# EAGLE design mysz (EAGLE 9.5.2)
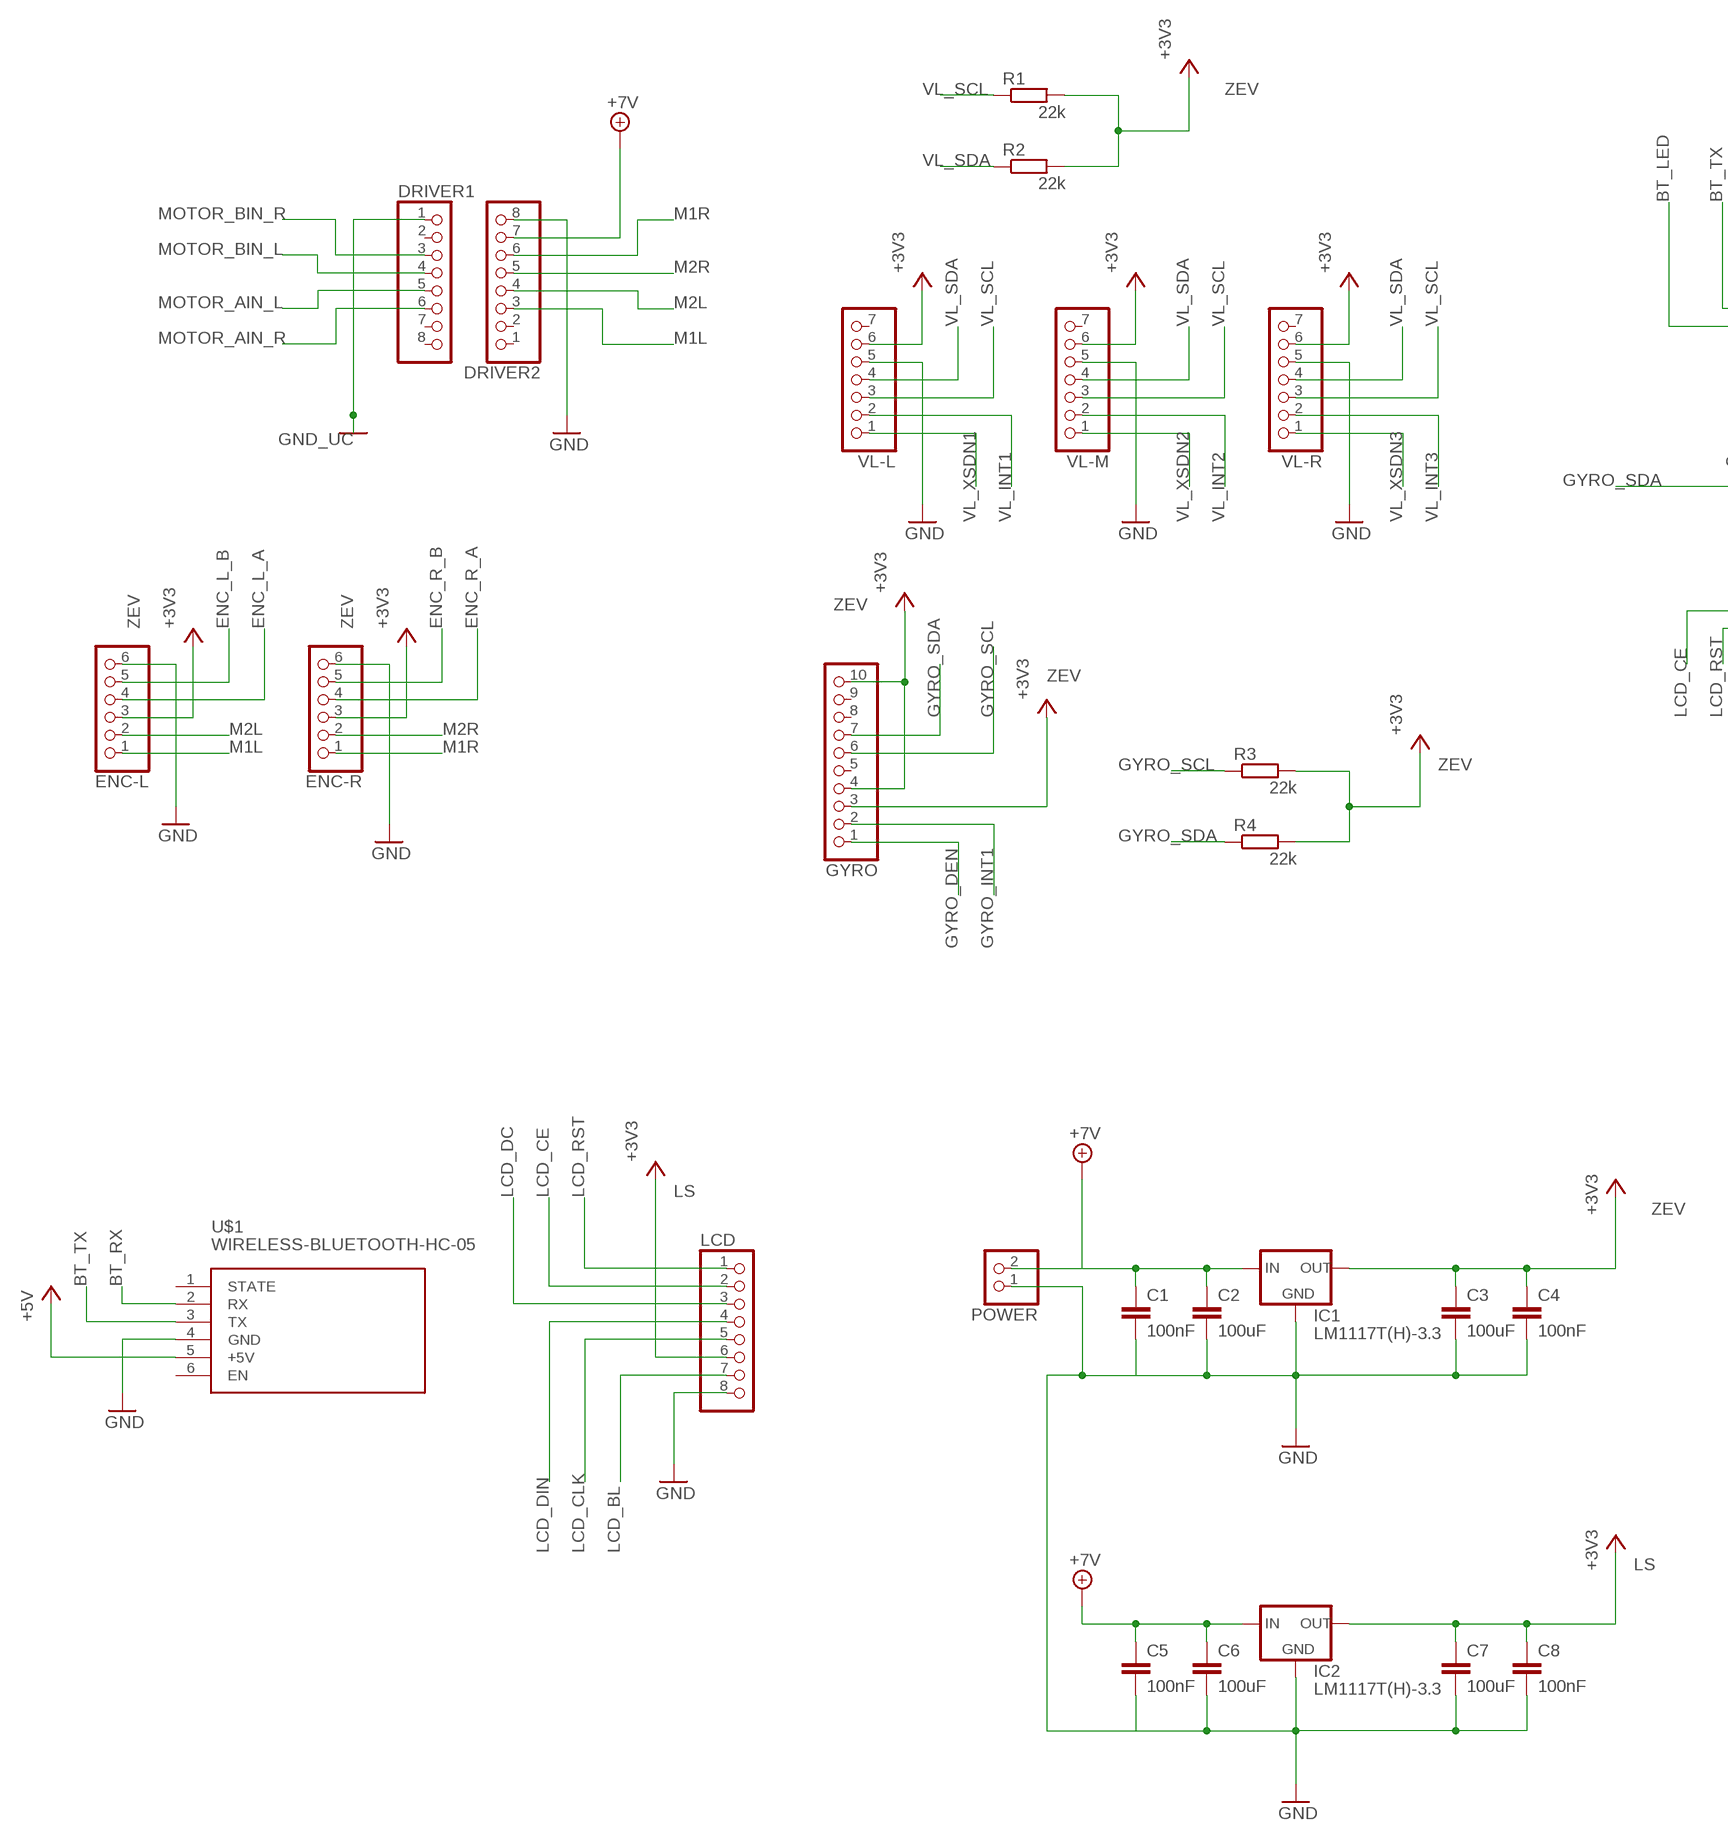
[diagram p0: schematic, sheet 1, part 1 of 2]
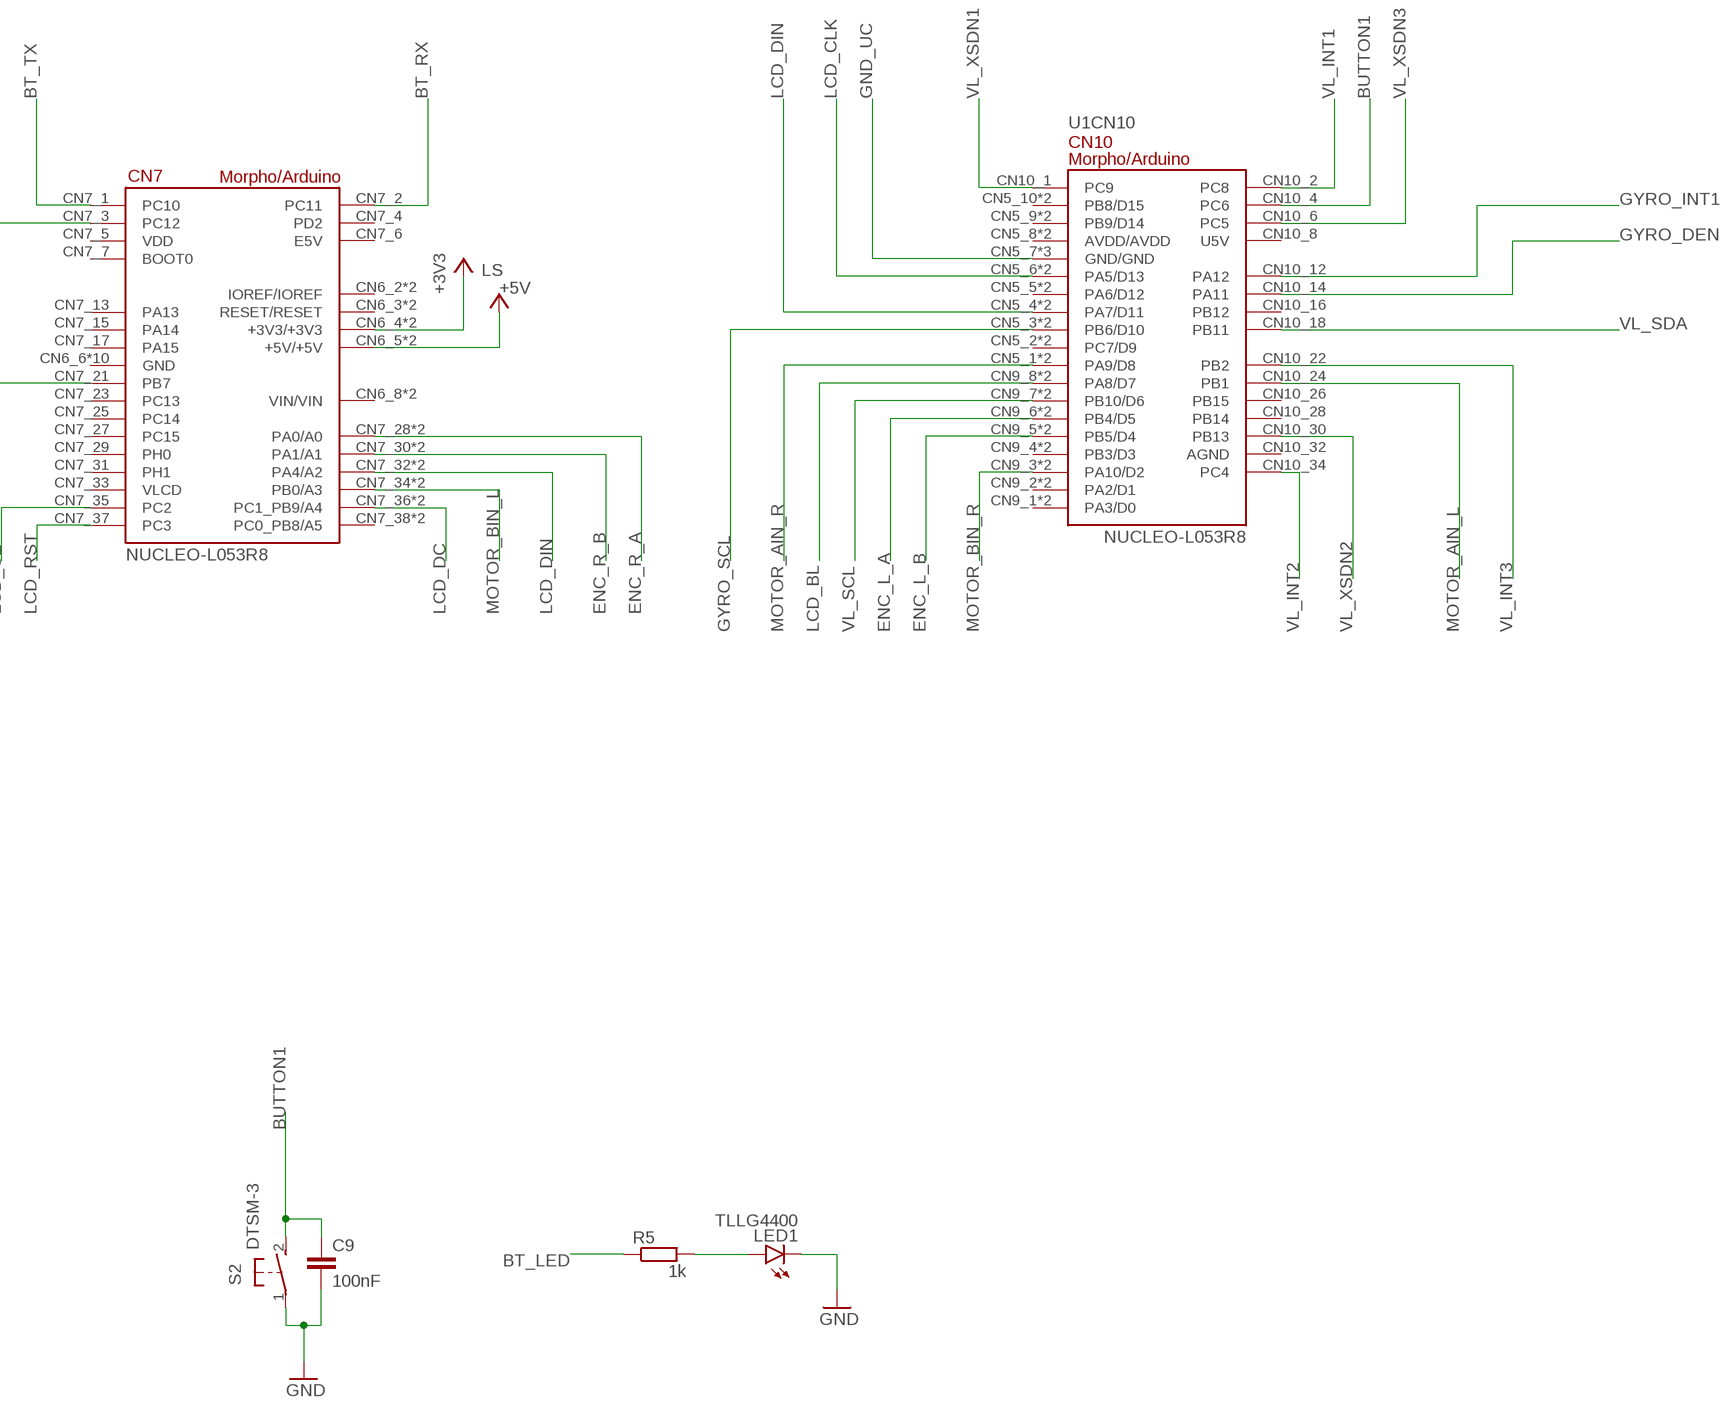
[diagram p1: schematic, sheet 1, part 2 of 2]

## Parts
C1  100nF  C2,5-3  [C2.5-3]
C2  100uF  C2,5-3  [C2.5-3]
C3  100uF  C2,5-3  [C2.5-3]
C4  100nF  C2,5-3  [C2.5-3]
C5  100nF  C2,5-3  [C2.5-3]
C6  100uF  C2,5-3  [C2.5-3]
C7  100uF  C2,5-3  [C2.5-3]
C8  100nF  C2,5-3  [C2.5-3]
C9  100nF  C2,5-3  [C2.5-3]
DRIVER1  PINHD-1X8  [1X08]
DRIVER2  PINHD-1X8  [1X08]
ENC-L  PINHD-1X6  [1X06]
ENC-R  PINHD-1X6  [1X06]
GYRO  PINHD-1X10  [1X10]
IC1  LM1117T(H)-3.3  [TO220H]
IC2  LM1117T(H)-3.3  [TO220H]
LCD  PINHD-1X8  [1X08]
LED1  TLLG4400  [LED3MM]
POWER  PINHD-1X2  [1X02]
R1  22k  R-EU_0207/10  [0207/10]
R2  22k  R-EU_0207/10  [0207/10]
R3  22k  R-EU_0207/10  [0207/10]
R4  22k  R-EU_0207/10  [0207/10]
R5  1k  R-EU_0207/10  [0207/10]
S2  DTSM-3  [DTSM-3]
U1  NUCLEO-L053R8  [MODULE_NUCLEO-L053R8]
U$1  WIRELESS-BLUETOOTH-HC-05  [WIRELESS-BLUETOOTH-HC-05]
VL-L  PINHD-1X7/90  [1X07/90]
VL-M  PINHD-1X7/90  [1X07/90]
VL-R  PINHD-1X7/90  [1X07/90]

## Nets
+3V3: VL-L.6 VL-M.6 VL-R.6
+5V: U1.CN6_5(CN7:+5V/+5V) U1.CN7_18(CN7:+5V/+5V) U$1.5(+5V)
+7V: C1.1 C2.1 C5.1 C6.1 IC1.3(IN) IC2.3(IN) POWER.2
BT_LED: R5.1 U1.CN7_3(CN7:PC12)
BT_RX: U1.CN7_2(CN7:PC11) U$1.2(RX)
BT_TX: U1.CN7_1(CN7:PC10) U$1.3(TX)
BUTTON1: C9.1 S2.2 U1.CN10_4(CN10:PC6)
ENC_L_A: ENC-L.4 U1.CN9_6(CN10:PB4/D5) U1.CN10_27(CN10:PB4/D5)
ENC_L_B: ENC-L.5 U1.CN9_5(CN10:PB5/D4) U1.CN10_29(CN10:PB5/D4)
ENC_R_A: ENC-R.4 U1.CN7_28(CN7:PA0/A0) U1.CN8_1(CN7:PA0/A0)
ENC_R_B: ENC-R.5 U1.CN7_30(CN7:PA1/A1) U1.CN8_2(CN7:PA1/A1)
GND: C1.2 C2.2 C3.2 C4.2 C5.2 C6.2 C7.2 C8.2 DRIVER2.8 ENC-L.6 ENC-R.6 IC1.1(GND) IC2.1(GND) LCD.8 POWER.1 U$1.4(GND) VL-L.5 VL-M.5 VL-R.5
GND_UC: DRIVER1.1 U1.CN5_7(CN10:GND/GND) U1.CN10_9(CN10:GND/GND) U1.CN10_20(CN10:GND/GND) ; supply symbol labelled GND
GYRO_DEN: GYRO.1 U1.CN10_14(CN10:PA11)
GYRO_INT1: GYRO.2 U1.CN10_12(CN10:PA12)
GYRO_SCL: GYRO.6 R3.1 U1.CN5_3(CN10:PB6/D10) U1.CN10_17(CN10:PB6/D10)
GYRO_SDA: GYRO.7 R4.1 U1.CN7_21(CN7:PB7)
LCD_BL: LCD.7 U1.CN9_8(CN10:PA8/D7) U1.CN10_23(CN10:PA8/D7)
LCD_CE: LCD.2 U1.CN7_35(CN7:PC2)
LCD_CLK: LCD.5 U1.CN5_6(CN10:PA5/D13) U1.CN10_11(CN10:PA5/D13)
LCD_DC: LCD.3 U1.CN7_36(CN7:PC1_PB9/A4) U1.CN8_5(CN7:PC1_PB9/A4)
LCD_DIN: LCD.4 U1.CN5_4(CN10:PA7/D11) U1.CN7_32(CN7:PA4/A2) U1.CN8_3(CN7:PA4/A2) U1.CN10_15(CN10:PA7/D11)
LCD_RST: LCD.1 U1.CN7_37(CN7:PC3)
LS: C7.1 C8.1 IC2.2(OUT) LCD.6 U1.CN6_4(CN7:+3V3/+3V3) U1.CN7_16(CN7:+3V3/+3V3) ; supply symbol labelled +3V3
M1L: DRIVER2.3 ENC-L.1
M1R: DRIVER2.6 ENC-R.1
M2L: DRIVER2.4 ENC-L.2
M2R: DRIVER2.5 ENC-R.2
MOTOR_AIN_L: DRIVER1.5 U1.CN10_24(CN10:PB1)
MOTOR_AIN_R: DRIVER1.6 U1.CN5_1(CN10:PA9/D8) U1.CN10_21(CN10:PA9/D8)
MOTOR_BIN_L: DRIVER1.4 U1.CN7_34(CN7:PB0/A3) U1.CN8_4(CN7:PB0/A3)
MOTOR_BIN_R: DRIVER1.3 U1.CN9_3(CN10:PA10/D2) U1.CN10_33(CN10:PA10/D2)
N$1: C9.2 LED1.K(C) S2.1 ; supply symbol labelled GND
N$5: LED1.A R5.2
N$6: DRIVER2.7 ; supply symbol labelled +7V
VL_INT1: U1.CN10_2(CN10:PC8) VL-L.2
VL_INT2: U1.CN10_34(CN10:PC4) VL-M.2
VL_INT3: U1.CN10_22(CN10:PB2) VL-R.2
VL_SCL: R1.1 U1.CN9_7(CN10:PB10/D6) U1.CN10_25(CN10:PB10/D6) VL-L.3 VL-M.3 VL-R.3
VL_SDA: R2.1 U1.CN10_18(CN10:PB11) VL-L.4 VL-M.4 VL-R.4
VL_XSDN1: U1.CN10_1(CN10:PC9) VL-L.1
VL_XSDN2: U1.CN10_30(CN10:PB13) VL-M.1
VL_XSDN3: U1.CN10_6(CN10:PC5) VL-R.1
ZEV: C3.1 C4.1 ENC-L.3 ENC-R.3 GYRO.3 GYRO.4 GYRO.10 IC1.2(OUT) R1.2 R2.2 R3.2 R4.2 ; supply symbol labelled +3V3
Unconnected: DRIVER1.2 DRIVER1.7 DRIVER1.8 DRIVER2.1 DRIVER2.2 GYRO.5 GYRO.8 GYRO.9 U1.CN5_2(CN10:PC7/D9) U1.CN5_5(CN10:PA6/D12) U1.CN5_8(CN10:AVDD/AVDD) U1.CN5_9(CN10:PB9/D14) U1.CN5_10(CN10:PB8/D15) U1.CN6_2(CN7:IOREF/IOREF) U1.CN6_3(CN7:RESET/RESET) U1.CN6_6(CN7:GND) U1.CN6_7(CN7:GND) U1.CN6_8(CN7:VIN/VIN) U1.CN7_4(CN7:PD2) U1.CN7_5(CN7:VDD) U1.CN7_6(CN7:E5V) U1.CN7_7(CN7:BOOT0) U1.CN7_8(CN7:GND) U1.CN7_12(CN7:IOREF/IOREF) U1.CN7_13(CN7:PA13) U1.CN7_14(CN7:RESET/RESET) U1.CN7_15(CN7:PA14) U1.CN7_17(CN7:PA15) U1.CN7_19(CN7:GND) U1.CN7_20(CN7:GND) U1.CN7_22(CN7:GND) U1.CN7_23(CN7:PC13) U1.CN7_24(CN7:VIN/VIN) U1.CN7_25(CN7:PC14) U1.CN7_27(CN7:PC15) U1.CN7_29(CN7:PH0) U1.CN7_31(CN7:PH1) U1.CN7_33(CN7:VLCD) U1.CN7_38(CN7:PC0_PB8/A5) U1.CN8_6(CN7:PC0_PB8/A5) U1.CN9_1(CN10:PA3/D0) U1.CN9_2(CN10:PA2/D1) U1.CN9_4(CN10:PB3/D3) U1.CN10_3(CN10:PB8/D15) U1.CN10_5(CN10:PB9/D14) U1.CN10_7(CN10:AVDD/AVDD) U1.CN10_8(CN10:U5V) U1.CN10_13(CN10:PA6/D12) U1.CN10_16(CN10:PB12) U1.CN10_19(CN10:PC7/D9) U1.CN10_26(CN10:PB15) U1.CN10_28(CN10:PB14) U1.CN10_31(CN10:PB3/D3) U1.CN10_32(CN10:AGND) U1.CN10_35(CN10:PA2/D1) U1.CN10_37(CN10:PA3/D0) U1.CN11_1(CN7:GND) U1.CN11_2(CN7:GND) U1.CN12_1(CN7:GND) U1.CN12_2(CN7:GND) U$1.1(STATE) U$1.6(EN) VL-L.7 VL-M.7 VL-R.7

## Library data of the parts
C1-C9 = capacitor-wima:C: CAPACITOR naming: grid - package width
DRIVER1 DRIVER2 LCD = pinhead:PINHD-1X8: PIN HEADER
ENC-L ENC-R = pinhead:PINHD-1X6: PIN HEADER
GYRO = pinhead:PINHD-1X10: PIN HEADER
IC1 IC2 = lm1117_10:LM1117?-*: 800mA Low-Dropout Linear Regulator Source: http://www.ti.com/lit/ds/symlink/lm1117-n.pdf; MF: Texas Instruments; MPN: LM1117T-3.3; OC_FARNELL: 1469056; OC_NEWARK: 13B5347
LED1 = led:TLLG4400: Low Current (2mA) LED 3 mm Tinted Diffused Package color GREEN Source: Data sheet <http://www.farnell.com/datasheets/391098.pdf>; MF: VISHAY SEMICONDUCTOR; OC_FARNELL: 1612435
POWER = pinhead:PINHD-1X2: PIN HEADER
R1-R5 = rcl:R-EU_: RESISTOR, European symbol; SPICEPREFIX: R
S2 = dtsm3:DTSM-3
U1 = NUCLEO-L053R8:NUCLEO-L053R8: STM32 Nucleo-64 development board with STM32L053R8T6 MCU, supports Arduino and ST morpho connectivity; AVAILABILITY: Unavailable; DESCRIPTION: STM32L053R8, mbed-Enabled Development Nucleo-64 STM32L0 ARM® Cortex®-M0+ MCU 32-Bit Embedded Evaluation Board; MF: STMicroelectronics; MP: NUCLEO-L053R8; PACKAGE: None; PRICE: None
U$1 = diy-modules:WIRELESS-BLUETOOTH-HC-05: Bluetooth Transceiver Module based on HC-05 board Tutorial is available here: https://arduino-info.wikispaces.com/BlueTooth-HC05-HC06-Modules-How-To Click here to find device on ebay.com <http://www.ebay.com/sch/hc-05+module+rs232>
VL-L VL-M VL-R = pinhead:PINHD-1X7: PIN HEADER

## Board
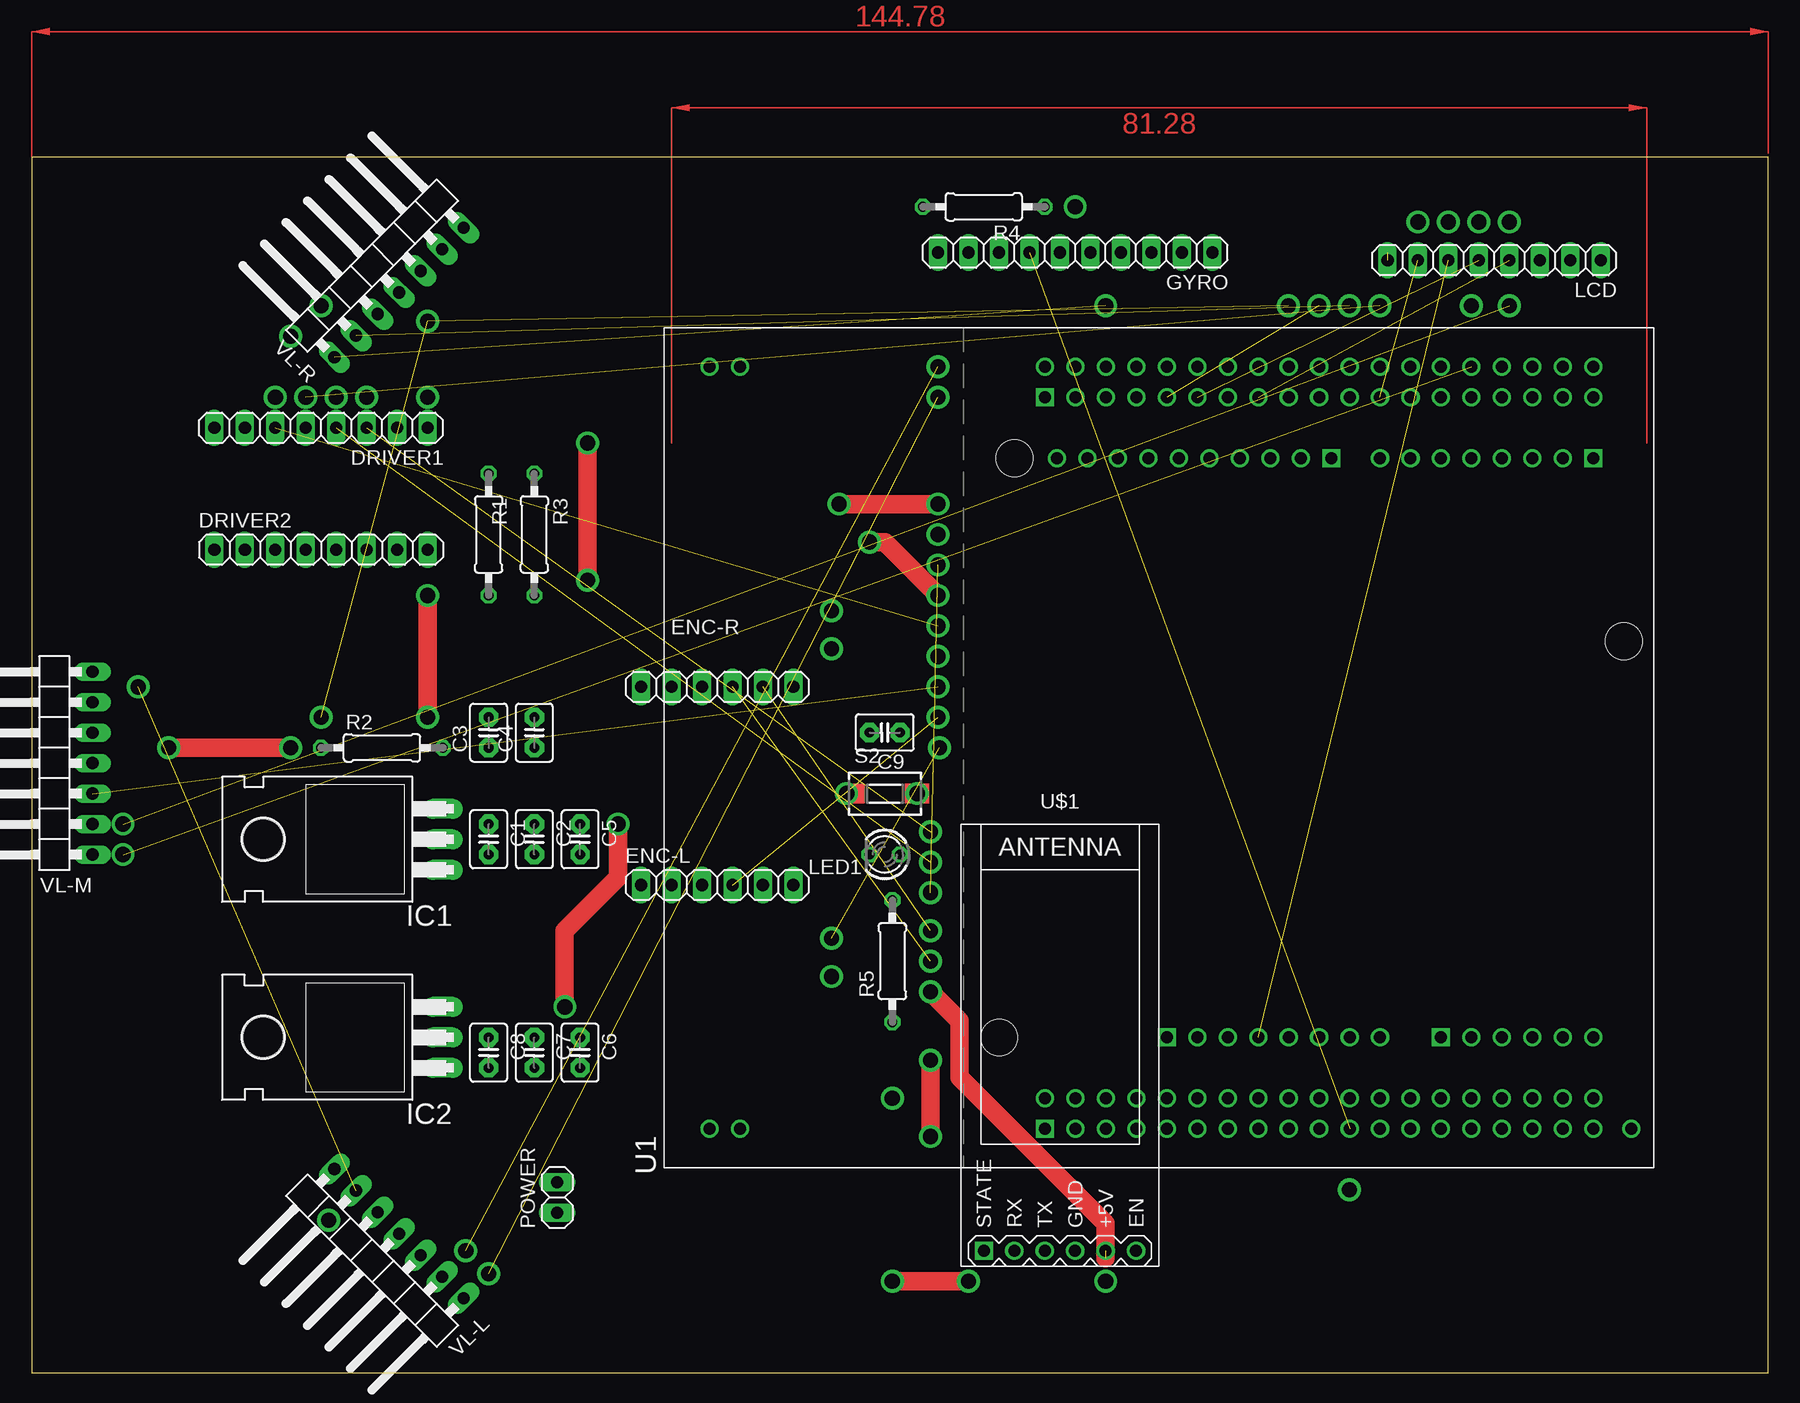
[diagram p2: board, top side]
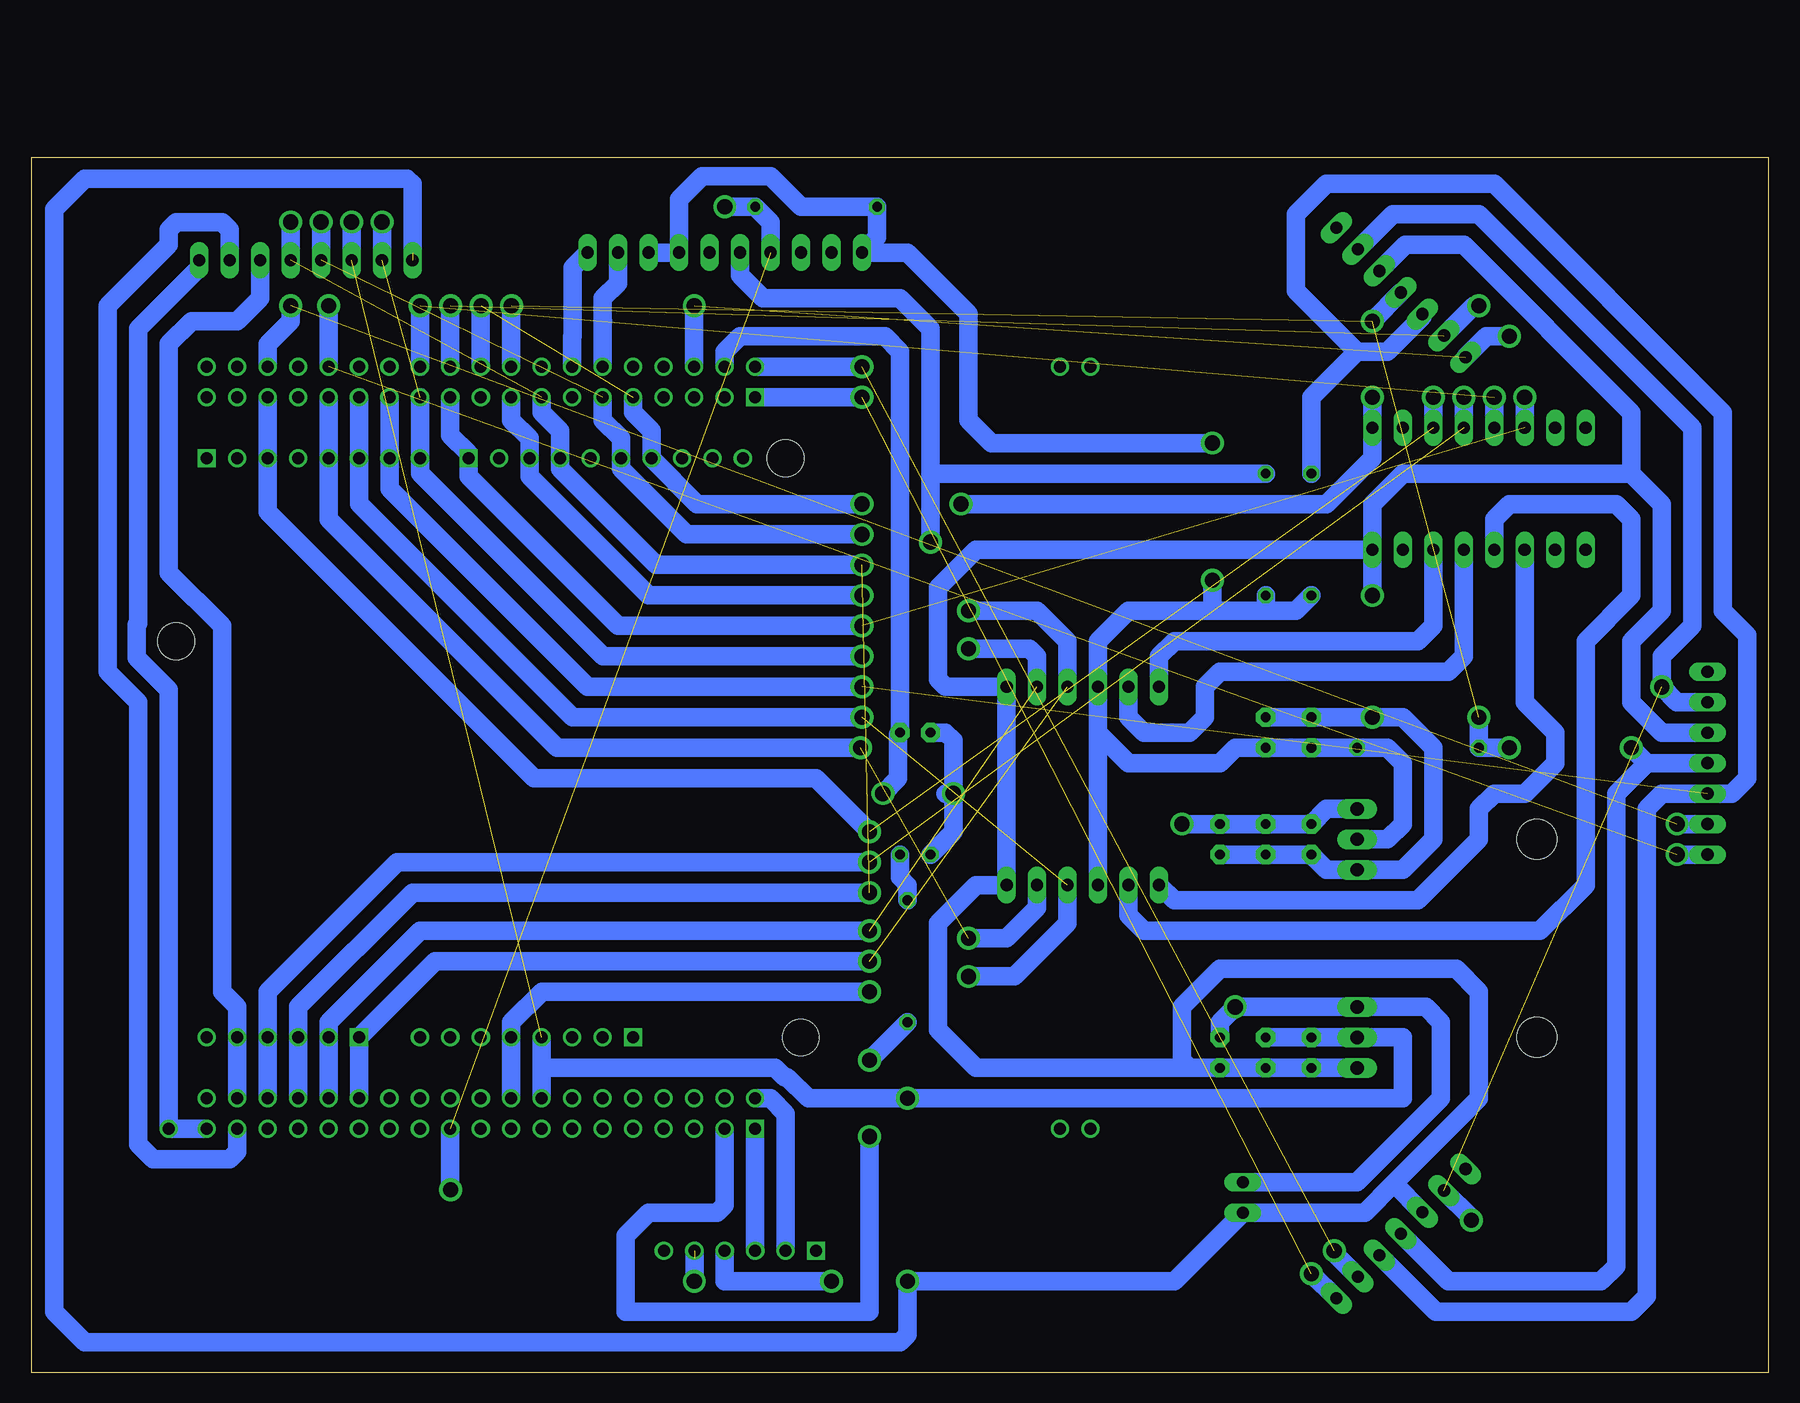
[diagram p3: board, bottom side, seen from below]

Size 144.76 x 101.27 mm. Coordinates in mm from the lower left corner, seen from the top.
Outline: 0,0 144.76,0 144.76,101.27 0,101.27 0,0
Copper layers (1*16): Top 0.035mm / dielectric 1.5mm / Bottom 0.035mm
Design rules "default": minimum track width 6mil, minimum drill 0.35mm, track to track 6mil, track to pad 6mil, pad to pad 6mil, via to via 6mil, smd to smd 6mil, copper to edge 40mil, drill to drill 6mil, minimum pad ring 10mil, minimum via ring 8mil, stop-mask expansion 4mil, vias tented up to drill 0mil, thermal gap 10mil

### Footprints (pad centres in the part's own frame; a part is rotated, then mirrored left to right if it is on the bottom)
C2.5-3 = drill 0.813 pad 1.6 octagon: 1 -1.27,0; 2 1.27,0
1X08 = drill 1.016 long: 1 -8.89,0; 2 -6.35,0; 3 -3.81,0; 4 -1.27,0; 5 1.27,0; 6 3.81,0; 7 6.35,0; 8 8.89,0
1X06 = drill 1.016 long: 1 -6.35,0; 2 -3.81,0; 3 -1.27,0; 4 1.27,0; 5 3.81,0; 6 6.35,0
1X10 = drill 1.016 long: 1 -11.43,0; 2 -8.89,0; 3 -6.35,0; 4 -3.81,0; 5 -1.27,0; 6 1.27,0; 7 3.81,0; 8 6.35,0; 9 8.89,0; 10 11.43,0
TO220H = drill 1.118 long: 1 -2.54,-10.16; 2 0,-10.16; 3 2.54,-10.16 | hole 3.302: 0,4.826
LED3MM = drill 0.813 octagon: A -1.27,0; K 1.27,0
1X02 = drill 1.016 long: 1 -1.27,0; 2 1.27,0
0207/10 = drill 0.813 octagon: 1 -5.08,0; 2 5.08,0
DTSM-3 = smd 2 x 1.6: 1 -2.7,0; 2 2.7,0
MODULE_NUCLEO-L053R8 = drill 1 square: CN5_1 24.13,-14.37; CN6_1 -24.13,-0.65; CN7_1 -31.75,9.51; CN8_1 -24.13,-23.51; CN9_1 24.13,-36.21; CN10_1 29.21,9.51 | drill 1: CN5_2 24.13,-11.83; CN5_3 24.13,-9.29; CN5_4 24.13,-6.75; CN5_5 24.13,-4.21; CN5_6 24.13,-1.67; CN5_7 24.13,0.87; CN5_8 24.13,3.41; CN5_9 24.13,5.95; CN5_10 24.13,8.49; CN6_2 -24.13,-3.19; CN6_3 -24.13,-5.73; CN6_4 -24.13,-8.27; CN6_5 -24.13,-10.81; CN6_6 -24.13,-13.35; CN6_7 -24.13,-15.89; CN6_8 -24.13,-18.43; CN7_2 -29.21,9.51; CN7_3 -31.75,6.97; CN7_4 -29.21,6.97; CN7_5 -31.75,4.43; CN7_6 -29.21,4.43; CN7_7 -31.75,1.89; CN7_8 -29.21,1.89; CN7_9 -31.75,-0.65; CN7_10 -29.21,-0.65; CN7_11 -31.75,-3.19; CN7_12 -29.21,-3.19; CN7_13 -31.75,-5.73; CN7_14 -29.21,-5.73; CN7_15 -31.75,-8.27; CN7_16 -29.21,-8.27; CN7_17 -31.75,-10.81; CN7_18 -29.21,-10.81; CN7_19 -31.75,-13.35; CN7_20 -29.21,-13.35; CN7_21 -31.75,-15.89; CN7_22 -29.21,-15.89; CN7_23 -31.75,-18.43; CN7_24 -29.21,-18.43; CN7_25 -31.75,-20.97; CN7_26 -29.21,-20.97; CN7_27 -31.75,-23.51; CN7_28 -29.21,-23.51; CN7_29 -31.75,-26.05; CN7_30 -29.21,-26.05; CN7_31 -31.75,-28.59; CN7_32 -29.21,-28.59; CN7_33 -31.75,-31.13; CN7_34 -29.21,-31.13; CN7_35 -31.75,-33.67; CN7_36 -29.21,-33.67; CN7_37 -31.75,-36.21; CN7_38 -29.21,-36.21; CN8_2 -24.13,-26.05; CN8_3 -24.13,-28.59; CN8_4 -24.13,-31.13; CN8_5 -24.13,-33.67; CN8_6 -24.13,-36.21; CN9_2 24.13,-33.67; CN9_3 24.13,-31.13; CN9_4 24.13,-28.59; CN9_5 24.13,-26.05; CN9_6 24.13,-23.51; CN9_7 24.13,-20.97; CN9_8 24.13,-18.43; CN10_2 31.75,9.51; CN10_3 29.21,6.97; CN10_4 31.75,6.97; CN10_5 29.21,4.43; CN10_6 31.75,4.43; CN10_7 29.21,1.89; CN10_8 31.75,1.89; CN10_9 29.21,-0.65; CN10_10 31.75,-0.65; CN10_11 29.21,-3.19; CN10_12 31.75,-3.19; CN10_13 29.21,-5.73; CN10_14 31.75,-5.73; CN10_15 29.21,-8.27; CN10_16 31.75,-8.27; CN10_17 29.21,-10.81; CN10_18 31.75,-10.81; CN10_19 29.21,-13.35; CN10_20 31.75,-13.35; CN10_21 29.21,-15.89; CN10_22 31.75,-15.89; CN10_23 29.21,-18.43; CN10_24 31.75,-18.43; CN10_25 29.21,-20.97; CN10_26 31.75,-20.97; CN10_27 29.21,-23.51; CN10_28 31.75,-23.51; CN10_29 29.21,-26.05; CN10_30 31.75,-26.05; CN10_31 29.21,-28.59; CN10_32 31.75,-28.59; CN10_33 29.21,-31.13; CN10_34 31.75,-31.13; CN10_35 29.21,-33.67; CN10_36 31.75,-33.67; CN10_37 29.21,-36.21; CN10_38 31.75,-36.21; CN11_1 31.75,37.45; CN11_2 31.75,34.91; CN12_1 -31.75,37.45; CN12_2 -31.75,34.91 | hole 3.05: 24.13,12.05; -24.13,13.32; 8.89,-38.75
WIRELESS-BLUETOOTH-HC-05 = drill 1 square: 1 -6.35,-17.145 | drill 1: 2 -3.81,-17.145; 3 -1.27,-17.145; 4 1.27,-17.145; 5 3.81,-17.145; 6 6.35,-17.145
1X07/90 = drill 1.016 long: 1 -7.62,-3.81; 2 -5.08,-3.81; 3 -2.54,-3.81; 4 0,-3.81; 5 2.54,-3.81; 6 5.08,-3.81; 7 7.62,-3.81

### Placement (x,y rotation side)
C1  38.1,44.45 270 top
C2  41.91,44.45 270 top
C3  38.1,53.34 90 top
C4  41.91,53.34 90 top
C5  45.72,44.45 270 top
C6  45.72,26.67 270 top
C7  41.91,26.67 270 top
C8  38.1,26.67 270 top
C9  71.12,53.34 180 top
DRIVER1  24.13,78.74 180 top
DRIVER2  24.13,68.58 0 top
ENC-L  57.15,40.64 0 top
ENC-R  57.15,57.15 0 top
GYRO  87,93.34 180 top
IC1  24.13,44.45 90 top
IC2  24.13,27.94 90 top
LCD  121.92,92.71 180 top
LED1  71.12,43.18 180 top
POWER  43.81,14.61 90 top
R1  38.1,69.85 270 top
R2  29.21,52.07 0 top
R3  41.91,69.85 270 top
R4  79.38,97.16 180 top
R5  71.75,34.29 90 top
S2  71.12,48.26 0 top
U1  93.98,52.07 90 top
U$1  85.72,27.3 0 top
VL-L  27.94,8.89 135 top
VL-M  1.27,50.8 90 top
VL-R  27.94,92.71 45 top

### Tracks (layer width: path | path; a pad name or v marks a point on that pad's centre or on a via)
+3V3  (via drill 1.27)  (1 unrouted)
  Bottom 1.524: VL-M.6 7.62,55.88 v8.89,57.15 8.89,59.69 6.35,62.23 6.35,78.74 24.13,96.52 31.31,96.52 VL-R.6 | VL-L.6 24.77,12.9 v24.77,12.7
+5V  (via drill 1.27)  (1 unrouted)
  Top 1.524: v74.93,31.75 77.36,29.32 77.36,24.63 89.53,12.45 89.53,9.53
  Bottom 1.524: U1.CN7_18 U1.CN6_5 104.79,29.2 102.23,31.75 v74.93,31.75 | U$1.5 v89.53,7.62
+7V  (via drill 1.27)
  Top 1.524: v44.45,30.48 44.45,36.83 48.9,41.27 v48.9,45.72
  Bottom 1.524: IC1.3 36.83,46.99 C1.1 C2.1 C5.1 v48.9,45.72 | C6.1 45.72,29.21 v44.45,30.48 IC2.3 28.57,30.48 27.3,29.21 27.3,22.86 34.29,15.88 POWER.2
BT_LED  (via drill 1.27)
  Top 1.524: v74.93,19.68 v74.93,26.04
  Bottom 1.524: U1.CN7_3 87.01,13.96 87.63,13.34 93.34,13.34 95.25,11.43 95.25,5.08 74.93,5.08 v74.93,19.68 | v74.93,26.04 R5.1
BT_RX
  Bottom 1.524: U1.CN7_2 83.19,22.86 81.92,21.59 U$1.2
BT_TX
  Bottom 1.524: U1.CN7_1 84.47,10.18 U$1.3
BUTTON1  (via drill 1.27)
  Bottom 1.524: U1.CN10_4 87.01,85.08 85.72,86.36 73.66,86.36 72.39,85.09 C9.1 72.55,53.18 72.55,49.53 S2.2
  other vias: 73.82,48.26
ENC_L_A  (via drill 1.27)  (1 unrouted)
  Bottom 1.524: U1.CN10_27 U1.CN9_6 117.49,72.41 99.69,54.61 v75.56,54.61 | v66.67,33.02 62.87,33.02 58.42,37.47 ENC-L.4
ENC_L_B  (via drill 1.27)  (1 unrouted)
  Bottom 1.524: U1.CN10_29 U1.CN9_5 120.03,71.14 100.97,52.07 v75.69,52.07 | ENC-L.5 60.96,38.73 63.5,36.2 v66.67,36.2
ENC_R_A  (via drill 1.27)  (1 unrouted)
  Bottom 1.524: U1.CN7_28 U1.CN8_1 111.14,34.29 v74.93,34.29 | ENC-R.4 58.42,60.96 60.96,63.5 v66.67,63.5
ENC_R_B  (via drill 1.27)  (1 unrouted)
  Bottom 1.524: U1.CN7_30 U1.CN8_2 120.02,27.95 120.02,29.21 112.39,36.83 v74.93,36.83 | ENC-R.5 60.96,59.69 61.59,60.33 v66.67,60.33
GND  (via drill 1.27)  (1 unrouted)
  Top 1.524: v33.02,54.61 v33.02,64.77 | v78.11,7.62 v71.75,7.62
  Bottom 1.524: C5.2 C2.2 C1.2 36.83,41.91 IC1.1 30.48,41.91 27.94,44.45 27.94,52.07 30.48,54.61 v33.02,54.61 C3.2 C4.2 | IC2.1 C8.2 C7.2 C6.2 48.26,25.4 | VL-M.5 8.89,53.34 11.43,55.88 11.43,60.96 8.89,63.5 8.89,72.39 11.43,74.93 | 11.43,74.93 30.48,74.93 33.02,72.39 DRIVER2.8 | 11.43,74.93 11.43,80.01 25.4,93.98 30.26,93.98 VL-R.5 | DRIVER2.8 33.02,66.04 | v33.02,64.77 DRIVER2.8 | U$1.4 87,7.62 v78.11,7.62 | 48.26,25.4 48.9,26.04 48.9,30.48 45.72,33.66 26.04,33.66 24.13,31.75 24.13,22.86 31.22,15.77 | VL-L.5 31.22,15.77 | 31.22,15.77 33.66,13.34 POWER.1 49.53,7.62 v71.75,7.62 71.75,3.17 72.39,2.54 140.34,2.54 142.88,5.08 142.88,96.95 140.34,99.49 113.46,99.49 113.03,99.06 113.03,93.34 | 48.26,25.4 66.04,25.4 69.22,28.57 69.22,37.47 66.04,40.64 ENC-L.6 ENC-R.6 68.58,57.15 69.22,57.78 69.22,65.41 66.04,68.58 DRIVER2.8
GND_UC  (via drill 1.27)  (1 unrouted)
  Top 1.524: v75.56,72.39 v67.31,72.39
  Bottom 1.524: v33.02,81.28 DRIVER1.1 33.02,76.2 36.83,72.39 v67.31,72.39 | U1.CN10_9 94.63,80.03 93.11,78.5 U1.CN5_7 89.3,72.39 v75.56,72.39 | U1.CN10_20 107.33,88.89 v107.31,88.9
GYRO_DEN
  Bottom 1.524: U1.CN10_14 99.71,86.34 99.69,86.36 99.69,92.08 GYRO.1
GYRO_INT1
  Bottom 1.524: U1.CN10_12 97.17,87.61 | 97.16,87.63 97.17,87.61 | 97.17,87.61 97.17,89.52 95.89,90.81 GYRO.2
GYRO_SCL  (via drill 1.27)
  Top 1.524: v75.56,64.77 71.12,69.22 v69.85,69.22
  Bottom 1.524: U1.CN10_17 104.79,79.39 103.27,77.87 U1.CN5_3 103.27,74.69 93.34,64.77 v75.56,64.77 | GYRO.6 85.72,91.44 83.82,89.53 72.39,89.53 69.85,87 69.85,74.93 | 69.85,74.93 v69.85,69.22 | R3.1 69.85,74.93
GYRO_SDA  (via drill 1.27)  (1 unrouted)
  Bottom 1.524: GYRO.7 83.19,95.89 R4.1 v87,97.16 | U1.CN7_21 109.87,15.26 v109.86,15.24
LCD_BL  (via drill 1.27)  (1 unrouted)
  Bottom 1.524: U1.CN10_23 U1.CN9_8 112.41,74.94 97.16,59.69 v75.56,59.69 | LCD.7 v115.57,95.89
LCD_CE
  Bottom 1.524: U1.CN7_35 127.65,18.4 128.27,17.78 134.62,17.78 135.89,19.05 135.89,55.88 138.43,58.42 138.43,88.9 133.35,93.98 133.35,95.25 132.72,95.89 128.91,95.89 128.27,95.25 LCD.2
LCD_CLK  (via drill 1.27)  (1 unrouted)
  Bottom 1.524: U1.CN10_11 97.17,79.39 95.65,77.87 U1.CN5_6 95.65,75.33 90.17,69.85 v75.56,69.85 | LCD.5 v120.65,95.89
LCD_DC
  Bottom 1.524: U1.CN7_36 U1.CN8_5 127.64,27.95 127.64,30.48 128.91,31.75 128.91,62.23 133.35,66.67 133.35,85.72 131.44,87.63 127.64,87.63 125.73,89.53 LCD.3
LCD_DIN  (via drill 1.27)  (2 unrouted)
  Bottom 1.524: U1.CN7_32 U1.CN8_3 122.56,27.95 122.56,30.48 113.03,40.01 v74.93,40.01 | U1.CN10_15 102.25,80.03 100.73,78.5 U1.CN5_4 100.73,75.33 92.71,67.31 v75.56,67.31 | LCD.4 v123.19,95.89
LCD_RST  (via drill 1)
  Bottom 1.524: LCD.1 130.81,92.08 135.89,87 135.89,62.47 136.03,62.33 136.03,59.59 133.35,56.91 v133.35,20.32 U1.CN7_37
LS  (via drill 1.27)  (1 unrouted)
  Bottom 1.524: U1.CN7_16 102.25,25.4 | 102.25,25.4 U1.CN6_4 | IC2.2 35.56,27.94 | IC2.2 C8.1 C7.1 | 102.25,25.4 82.79,25.4 82.03,24.64 81.79,24.64 80.01,22.86 v71.75,22.86 30.48,22.86 30.48,27.94 IC2.2 | LCD.6 v118.11,95.89
M1L
  Bottom 1.524: ENC-L.1 49.53,39.37 29.21,39.37 24.13,44.45 24.13,46.99 22.86,48.26 20.32,48.26 17.78,50.8 17.78,53.34 20.32,55.88 DRIVER2.3
M1R
  Bottom 1.524: DRIVER2.6 27.94,62.23 29.21,60.96 49.53,60.96 50.8,59.69 ENC-R.1
M2L
  Bottom 1.524: ENC-L.2 53.34,38.1 52.07,36.83 19.05,36.83 15.24,40.64 15.24,60.96 11.43,64.77 11.43,71.12 12.7,72.39 21.59,72.39 22.86,71.12 DRIVER2.4
M2R
  Bottom 1.524: ENC-R.2 53.34,54.61 52.07,53.34 48.26,53.34 46.99,54.61 46.99,57.15 45.72,58.42 26.67,58.42 25.4,59.69 DRIVER2.5
MOTOR_AIN_L  (via drill 1.27)  (1 unrouted)
  Bottom 1.524: DRIVER1.5 v22.86,81.28 | U1.CN10_24 112.41,88.89 v112.39,88.9
MOTOR_AIN_R  (via drill 1.27)  (1 unrouted)
  Bottom 1.524: DRIVER1.6 v20.32,81.28 | U1.CN10_21 109.87,78.12 108.35,76.6 U1.CN5_1 108.35,74.69 95.89,62.23 v75.56,62.23
MOTOR_BIN_L  (via drill 1.27)  (1 unrouted)
  Bottom 1.524: U1.CN7_34 U1.CN8_4 125.11,31.73 114.3,42.55 v74.93,42.55 | DRIVER1.4 v25.4,81.28
MOTOR_BIN_R  (via drill 1.27)  (1 unrouted)
  Bottom 1.524: U1.CN10_33 U1.CN9_3 125.09,76.19 125.09,71.75 102.87,49.53 79.38,49.53 v74.93,45.09 | DRIVER1.3 v27.94,81.28
N$1  (via drill 1.27)
  Top 1.524: S2.1 v67.94,48.26
  Bottom 1.524: C9.2 68.58,53.34 67.94,52.7 v67.94,48.26 | v67.94,48.26 67.94,45.09 LED1.K | v67.94,48.26 68.58,48.26
N$5
  Bottom 1.524: R5.2 71.75,40.64 72.39,41.27 LED1.A
VL_INT1  (via drill 1.27)  (1 unrouted)
  Bottom 1.524: U1.CN10_2 v75.56,83.82 | VL-L.2 36.2,9.96 v36.2,10.16
VL_INT2  (via drill 1.27)  (1 unrouted)
  Bottom 1.524: VL-M.2 v7.62,45.72 | U1.CN10_34 125.11,85.71 123.19,87.63 v123.19,88.9
VL_INT3  (via drill 1.27)  (1 unrouted)
  Bottom 1.524: VL-R.2 24.57,88.9 v24.13,88.9 | U1.CN10_22 109.87,88.89 v109.86,88.9
VL_SCL  (via drill 1.27)  (1 unrouted)
  Bottom 1.524: U1.CN10_25 U1.CN9_7 114.95,73.67 98.42,57.15 v75.56,57.15 | VL-L.3 27.72,5.08 11.43,5.08 10.16,6.35 10.16,46.99 8.89,48.26 VL-M.3 3.05,48.26 1.78,49.53 1.78,61.47 3.81,63.5 3.81,80.01 22.86,99.06 36.83,99.06 39.37,96.52 39.37,90.17 34.29,85.09 | 34.29,85.09 31.75,85.09 28.84,88 VL-R.3 | R1.1 38.1,81.28 34.29,85.09
VL_SDA  (via drill 1.27)  (2 unrouted)
  Top 1.524: v21.59,52.07 v11.43,52.07
  Bottom 1.524: VL-L.4 26.67,7.62 13.97,7.62 12.7,8.89 12.7,48.26 10.16,50.8 | 10.16,50.8 VL-M.4 | v21.59,52.07 R2.1 v24.13,54.61 | v11.43,52.07 10.16,50.8 | VL-R.4 v33.02,87.63 | v33.02,87.63 | U1.CN10_18 104.79,88.89 v104.78,88.9
VL_XSDN1  (via drill 1.27)  (1 unrouted)
  Bottom 1.524: U1.CN10_1 v75.56,81.28 | VL-L.1 38.08,8.26 v38.1,8.26
VL_XSDN2  (via drill 1.27)  (1 unrouted)
  Bottom 1.524: VL-M.1 v7.62,43.18 | U1.CN10_30 120.03,88.89 v120.02,88.9
VL_XSDN3  (via drill 1.27)  (1 unrouted)
  Bottom 1.524: VL-R.1 23.51,86.36 v21.59,86.36 | U1.CN10_6 89.55,88.89 v89.53,88.9
ZEV  (via drill 1.27)
  Top 1.524: v46.35,66.04 v46.35,77.47
  Bottom 1.524: 33.02,44.45 IC1.2 31.75,44.45 30.48,45.72 30.48,50.8 31.75,52.07 R2.2 C3.1 C4.1 44.45,52.07 45.72,50.8 53.34,50.8 55.88,53.34 | 55.88,53.34 ENC-R.3 55.88,60.96 53.34,63.5 46.35,63.5 | ENC-L.3 55.88,53.34 | R1.2 39.37,63.5 41.91,63.5 | 41.91,63.5 46.35,63.5 | R3.2 41.91,63.5 | GYRO.3 GYRO.4 90.81,97.79 88.9,99.69 83.19,99.69 80.64,97.16 R4.2 74.3,94.61 GYRO.10 71.75,93.34 66.67,88.27 66.67,79.38 64.77,77.47 v46.35,77.47 | 46.35,63.5 v46.35,66.04
(copper drawn outside any net)
  shapes: Top area x5